# EAGLE design V5.0 (EAGLE 6.1)
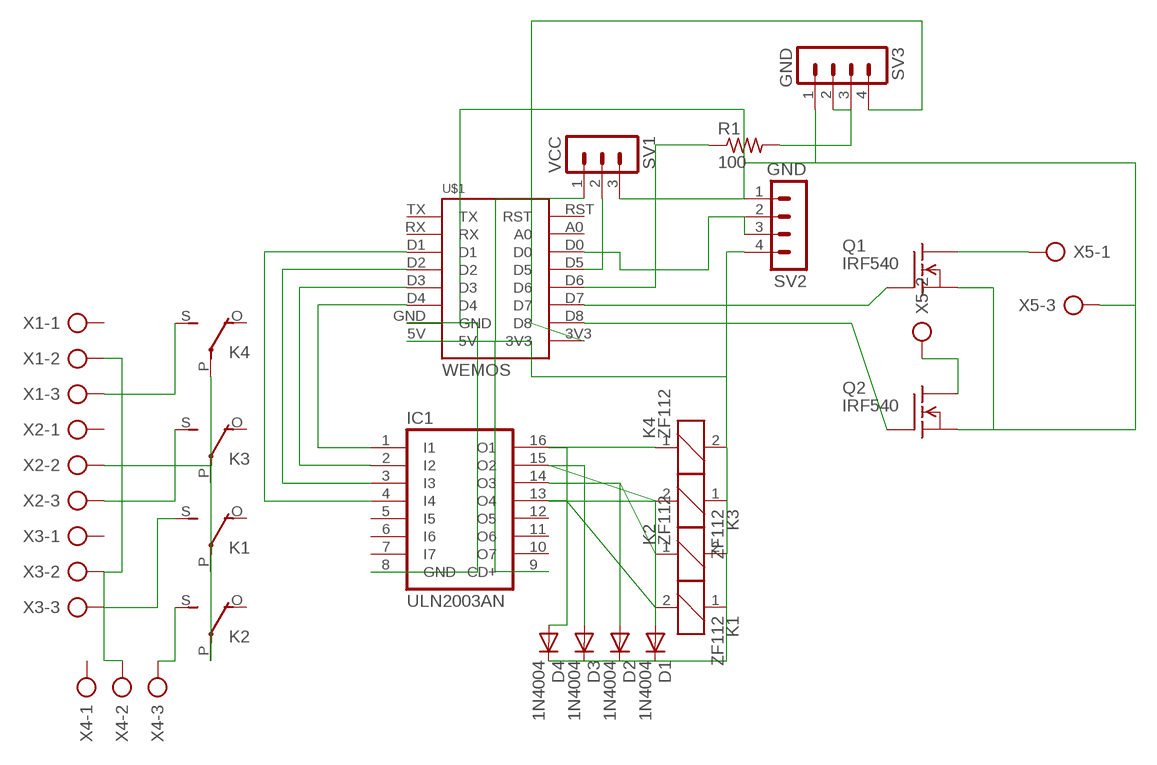
[diagram p0: schematic, sheet 1]

## Parts
D1  1N4004  [DO41-10]
D2  1N4004  [DO41-10]
D3  1N4004  [DO41-10]
D4  1N4004  [DO41-10]
IC1  ULN2003AN  [DIL16]
K1  ZF112  [ZF112]
K2  ZF112  [ZF112]
K3  ZF112  [ZF112]
K4  ZF112  [ZF112]
Q1  IRF540  [TO220]
Q2  IRF540  [TO220]
R1  100  R-US_0207/7  [0207/7]
SV1  VCC  MA03-1  [MA03-1]
SV2  GND  MA04-1  [MA04-1]
SV3  GND  MA04-1  [MA04-1]
U$1  WEMOS  [WEMOS]
X1  AK300/3  [AK300/3]
X2  AK300/3  [AK300/3]
X3  AK300/3  [AK300/3]
X4  AK300/3  [AK300/3]
X5  AK300/3  [AK300/3]

## Nets
N$1: IC1.4(I4) U$1.D1
N$2: IC1.3(I3) U$1.D2
N$3: IC1.2(I2) U$1.D3
N$4: IC1.1(I1) U$1.D4
N$5: IC1.8(GND) Q1.3(S) Q2.3(S) SV1.3 SV2.1 SV3.1 U$1.GND X5.3
N$6: D1.C D2.C D3.C D4.C IC1.9(CD+) K1.1 K2.2 K3.1 K4.2 SV1.1 SV2.4 U$1.5V
N$7: D3.A IC1.15(O2) K3.2
N$8: D1.A IC1.13(O4) K1.2
N$9: D2.A IC1.14(O3) K2.1
N$10: D4.A IC1.16(O1) K4.1
N$12: K4.S(2:S) X1.3
N$13: K3.S(2:S) X2.3
N$14: K1.S(2:S) X3.3
N$15: K2.S(2:S) X4.3
N$16: K1.P(2:P) K2.P(2:P) K3.P(2:P) K4.P(2:P) X1.2 X2.2 X3.2 X4.2
N$17: SV1.2 U$1.D5
N$19: SV2.2 SV2.3 U$1.D0
N$20: SV3.4 U$1.3V3
N$21: Q1.1(G) U$1.D7
N$22: Q2.1(G) U$1.D8
N$24: Q1.2(D) X5.1
N$25: Q2.2(D) X5.2
N$27: R1.2 SV3.2 SV3.3
N$28: R1.1 U$1.D6
Unconnected: IC1.5(I5) IC1.6(I6) IC1.7(I7) IC1.10(O7) IC1.11(O6) IC1.12(O5) K1.O(2:O) K2.O(2:O) K3.O(2:O) K4.O(2:O) U$1.A0 U$1.RST U$1.RX U$1.TX X1.1 X2.1 X3.1 X4.1

## Library data of the parts
D1-D4 = diode:1N4004: DIODE general purpose rectifier, 1 A
IC1 = uln-udn:ULN2003A: DRIVER ARRAY
K1-K4 = relay:ZF112: RELAY 1 x switch; OC_FARNELL: unknown; OC_NEWARK: unknown
Q1 Q2 = transistor-fet:IRF540: N-Channel Enhancement MOSFET (HEXFET); 100V; 28A; 0,077Ohm
R1 = rcl:R-US_: RESISTOR, American symbol
SV1 = con-lstb:MA03-1: PIN HEADER; OC_FARNELL: unknown; OC_NEWARK: unknown
SV2 SV3 = con-lstb:MA04-1: PIN HEADER; OC_FARNELL: unknown; OC_NEWARK: unknown
U$1 = Wemos:WEMOS
X1-X5 = con-ptr500:AK300/3: CONNECTOR; OC_FARNELL: unknown; OC_NEWARK: unknown

## Board
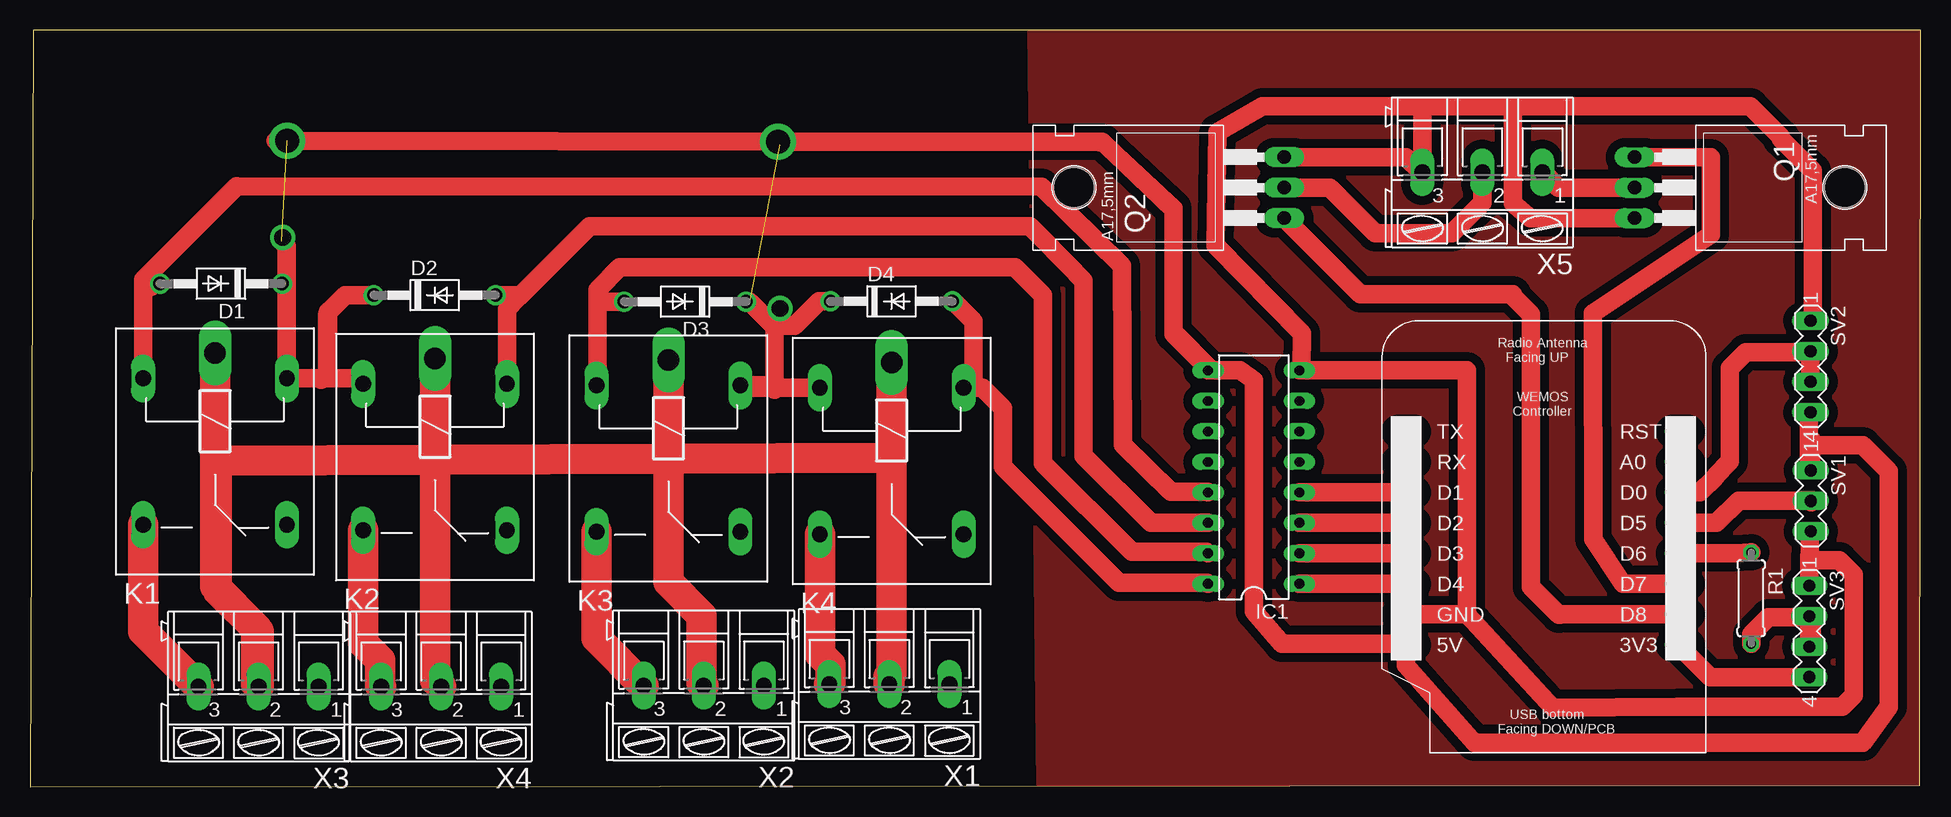
[diagram p1: board, top side]
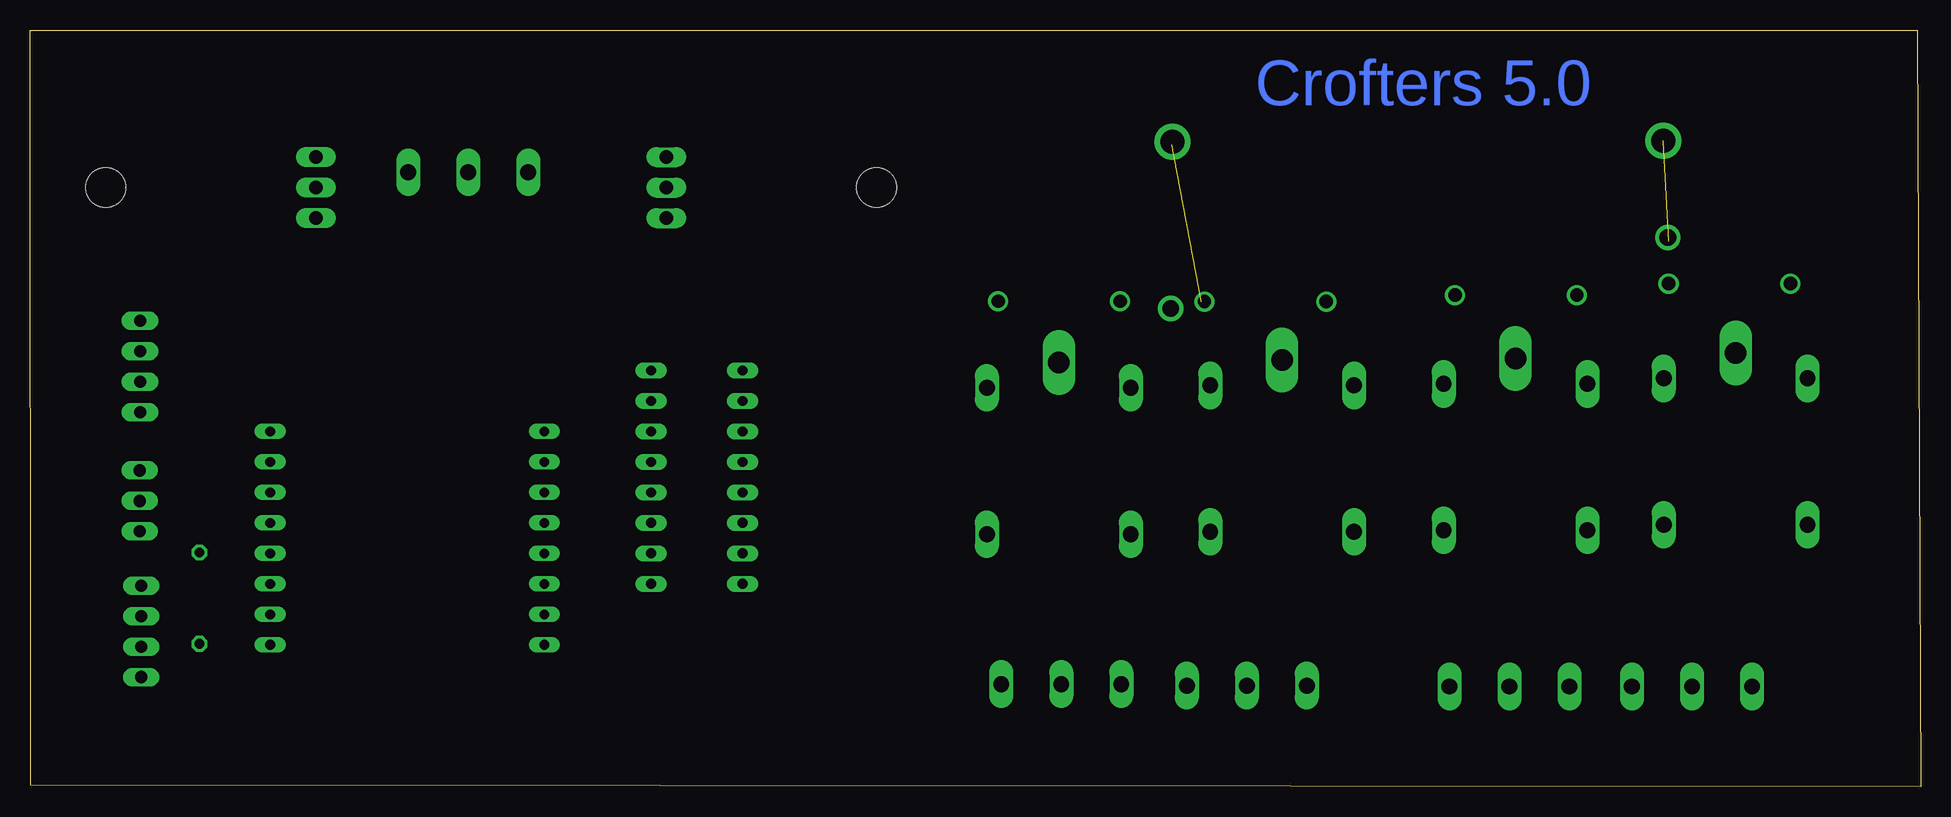
[diagram p2: board, bottom side, seen from below]

Size 157.59 x 63.07 mm. Coordinates in mm from the lower left corner, seen from the top.
Outline: 0,0 157.51,0.13 157.59,63.07 0.28,63.07 0,0
Copper layers (1*16): Top 0.035mm / dielectric 1.5mm / Bottom 0.035mm
Design rules: minimum track width 60mil, minimum drill 24mil, track to track 30mil, track to pad 35mil, pad to pad 8mil, via to via 8mil, smd to smd 8mil, copper to edge 1mil, drill to drill 20mil, minimum pad ring 10mil, minimum via ring 8mil, stop-mask expansion 4mil, vias tented up to drill 0mil, thermal gap 10mil

### Footprints (pad centres in the part's own frame; a part is rotated, then mirrored left to right if it is on the bottom)
DO41-10 = drill 1.118: A 5.08,0; C -5.08,0
DIL16 = drill 0.813 long: 1 -8.89,-3.81; 2 -6.35,-3.81; 3 -3.81,-3.81; 4 -1.27,-3.81; 5 1.27,-3.81; 6 3.81,-3.81; 7 6.35,-3.81; 8 8.89,-3.81; 9 8.89,3.81; 10 6.35,3.81; 11 3.81,3.81; 12 1.27,3.81; 13 -1.27,3.81; 14 -3.81,3.81; 15 -6.35,3.81; 16 -8.89,3.81
ZF112 = drill 1.321 long: 1 -6.096,5.994; 2 -6.096,-5.994; O 6.096,5.994; S 6.096,-5.994 | drill 1.803 long: P -8.204,0
TO220 = drill 1.118 long: 1 -2.54,-6.35; 2 0,-6.35; 3 2.54,-6.35 | hole 3.302: 0,11.176
0207/7 = drill 0.813 octagon: 1 -3.81,0; 2 3.81,0
MA03-1 = drill 1.016 long: 1 -2.54,0; 2 0,0; 3 2.54,0
MA04-1 = drill 1.016 long: 1 -3.81,0; 2 -1.27,0; 3 1.27,0; 4 3.81,0
WEMOS = drill 0.8 long: 3V3 22.86,0; 5V 0,0; A0 22.86,15.24; D0 22.86,12.7; D1 0,12.7; D2 0,10.16; D3 0,7.62; D4 0,5.08; D5 22.86,10.16; D6 22.86,7.62; D7 22.86,5.08; D8 22.86,2.54; GND 0,2.54; RST 22.86,17.78; RX 0,15.24; TX 0,17.78
AK300/3 = drill 1.321 long: 1 -5.004,0; 2 0,0; 3 5.004,0

### Placement (x,y rotation side)
D1  15.93,41.94 180 top
D2  33.73,40.97 0 top
D3  54.61,40.44 180 top
D4  71.81,40.46 0 top
IC1  102.01,25.81 90 top
K1  15.42,27.94 270 top
K2  33.76,27.48 270 top
K3  53.21,27.36 270 top
K4  71.83,27.15 270 top
Q1  140.11,49.94 270 top
Q2  98.2,49.94 90 top
R1  143.46,15.72 270 top
SV1  148.44,23.83 270 top
SV2  148.41,35.03 270 top
SV3  148.31,12.95 270 top
U$1  114.71,11.84 0 top
X1  71.63,8.56 180 top
X2  56.16,8.43 180 top
X3  19.05,8.36 180 top
X4  34.26,8.36 180 top
X5  121.06,51.21 180 top

### Tracks (layer width: path | path; a pad name or v marks a point on that pad's centre or on a via)
N$1
  Top 1.524: IC1.4 U$1.D1
N$2
  Top 1.524: IC1.3 U$1.D2
N$3
  Top 1.524: IC1.2 U$1.D3
N$4
  Top 1.524: IC1.1 U$1.D4
N$5
  Top 1.524: Q2.3 114.71,52.48 115.98,51.21 X5.3 116.05,56.62 116.15,56.72 | 119.79,14.38 U$1.GND | 119.79,14.38 119.79,34.7 106.12,34.7 | IC1.8 106.12,34.7 | 119.79,14.38 126.95,6.6 137.36,6.68 151.08,6.68 152.02,7.62 152.02,17.68 150.83,18.87 148.74,18.87 148.64,18.97 148.36,19.53 | 106.12,34.7 105.97,34.85 106.02,37.79 98.83,45.11 98.96,54.53 102.72,56.72 116.15,56.72 | 116.15,56.72 123.32,56.72 | 123.32,56.72 143.41,56.72 145.95,54.18 145.95,54.03 148.62,51.36 148.62,39.37 148.44,39.19 148.44,38.96 148.41,38.94 SV2.1 | Q1.3 125.04,47.4 123.6,48.64 123.6,56.24 123.32,56.72 | 148.23,21.08 SV1.3 148.36,21.08 148.36,19.53 | SV3.1 148.31,19.2 148.36,19.53
N$6  (via drill 2)  (2 unrouted)
  Top 1.524: K4.2 59.41,33.25 K3.1 61.72,33.45 62.08,33.1 62.08,38.35 | 24.64,34.04 K1.1 21.41,41.68 | 24.64,34.04 27.31,34.04 K2.2 | 21.41,41.68 21.41,45.03 20.98,45.47 | 62.08,38.35 62.08,38.43 | 62.08,38.43 62.08,39.32 62.53,39.78 | 20.47,53.82 v21.44,53.82 89.15,53.7 89.43,53.7 95.3,48.08 95.3,37.77 98.25,34.82 | 98.25,34.82 98.25,34.75 IC1.9 100.86,34.7 102.01,33.88 102.01,14.63 104.37,11.94 114.68,11.94 115.04,11.58 114.96,11.58 U$1.5V 114.71,10.13 120.4,3.66 152.76,3.66 154.94,6.68 154.94,26.29 152.76,28.47 148.67,28.47 148.46,28.68 | 98.25,34.82 98.25,34.98 95.63,37.59 95.53,37.59 95.43,37.69 95.43,37.85 95.33,37.95 95.33,48.23 89.36,53.77 62.74,53.77 62.46,53.49 | 148.46,28.96 148.46,28.68 | 148.46,28.68 148.46,26.59 148.29,26.42 | 148.29,26.42 148.29,31.09 SV2.4 | SV1.1 148.34,26.36 148.29,26.42 | D1.C 21.16,41.94 21.41,41.68 | 24.26,33.93 24.79,34.47 24.79,39.32 24.82,39.34 24.82,39.5 | 24.87,39.62 24.87,39.5 | 24.87,39.5 24.87,34.26 24.64,34.04 | D2.C 26.29,40.97 24.82,39.5 | 24.82,39.5 24.87,39.5 | D3.C 59.99,40.44 62.08,38.35 | D4.C 65.76,40.46 63.73,38.43 62.08,38.43
N$7
  Top 1.524: 47.29,40.21 47.29,41.43 49.15,43.28 82.12,43.28 84.46,40.94 84.46,26.97 91.85,19.58 98.07,19.58 IC1.15 | 47.29,40.21 47.29,33.53 K3.2 | D3.A 47.52,40.44 47.29,40.21
N$8
  Top 1.524: K1.2 9.42,41.48 | 9.42,41.48 9.42,42.24 17.25,50.06 84.33,50.01 91.01,43.43 91.08,28.5 95.1,24.59 98.15,24.59 IC1.13 | D1.A 10.34,41.94 10.08,41.68 9.63,41.68 9.42,41.48
N$9
  Top 1.524: IC1.14 93.42,22 87.81,27.61 87.81,42.19 87.15,42.85 87.15,42.9 83.34,46.71 46.66,46.71 40.73,40.78 | K2.1 39.75,39.8 40.73,40.78 | D2.A 40.54,40.97 40.73,40.78
N$10
  Top 1.524: IC1.16 98.12,16.99 90.78,16.99 81.1,26.67 81.1,31.55 79.4,33.25 K4.1 78.64,34.06 78.64,38.79 76.96,40.46 D4.A
N$11
  pour Top: 83.34,63.22 157.58,63.07 157.56,0.18 84.12,0
N$12
  Top 2.54: K4.S 65.84,11.05 66.73,10.16 66.73,8.66 X1.3
N$13
  Top 2.54: K3.S 47.22,12.37 X2.3
N$14
  Top 2.54: K1.S 9.42,12.98 X3.3
N$15
  Top 2.54: K2.S 27.76,11.96 29.18,10.54 29.18,8.43 X4.3
N$16
  Top 1.524: 33.76,8.86 33.76,27.04 33.55,27.24 | X2.2 56.16,14.05 53.49,16.71 53.49,27.01 53.16,27.34
  Top 2.54: K1.P 15.42,16.71 18.87,13.26 18.87,8.53 X3.2 19.05,12.95 15.7,16.31 15.7,16.46 15.54,16.61 15.54,27.15 15.93,27.15 33.55,27.24 53.16,27.34 71.15,27.43 71.83,26.75 | K2.P 33.76,8.86 X4.2 | K4.P 71.83,26.75 | 71.83,26.75 71.83,9.42 71.58,9.17 71.58,8.61 X1.2 | K3.P 53.21,17.04 55.98,14.27 55.98,8.61 X2.2
N$17
  Top 1.524: U$1.D5 140.56,22 142.42,23.85 148.29,23.85 | 148.44,23.85 148.56,23.85 148.59,23.88 147.73,23.88 148.51,23.77 148.46,23.72 148.46,23.85 148.49,23.88 148.49,23.9 148.44,23.85 | SV1.2 148.31,23.82 148.29,23.85 | 148.29,23.85 148.44,23.85
N$18  (via drill 1.4)
  other vias: 21.06,45.77
N$19
  Top 1.524: U$1.D0 139.19,24.54 140.46,25.81 140.46,25.88 141.71,27.13 141.71,34.9 143.03,36.22 148.34,36.22 SV2.2 SV2.3
N$20
  Top 1.524: SV3.4 140.06,9.14 137.57,11.63 U$1.3V3
N$21
  Top 1.524: U$1.D7 132.79,16.92 130.3,20.62 130.28,39.47 140.11,46 140.11,52.48 Q1.1
N$22
  Top 1.524: 123.57,41.05 110.9,41.05 Q2.1 | U$1.D8 127.56,14.38 127.53,14.35 127.43,14.35 125.1,16.69 125.1,39.4 123.57,40.92 123.57,41.05 | 123.57,41.05 123.6,41.05
N$23  (via drill 1.4)
  other vias: 62.51,39.85
N$24
  Top 1.524: Q1.2 127.41,49.94 126.14,51.21 X5.1
N$25
  Top 1.524: Q2.2 108.36,49.94 112.17,46.13 118.52,46.13 121.06,48.67 X5.2
N$26  (via drill 2)
  other vias: 62.36,53.75
N$27
  Top 1.524: R1.2 143.46,12.7 144.88,14.12 148.44,14.12 148.51,14.05 148.51,11.89 SV3.3 SV3.2
N$28
  Top 1.524: U$1.D6 142.11,19.46 R1.1

### Text on the board
Bottom: Crofters 5.0